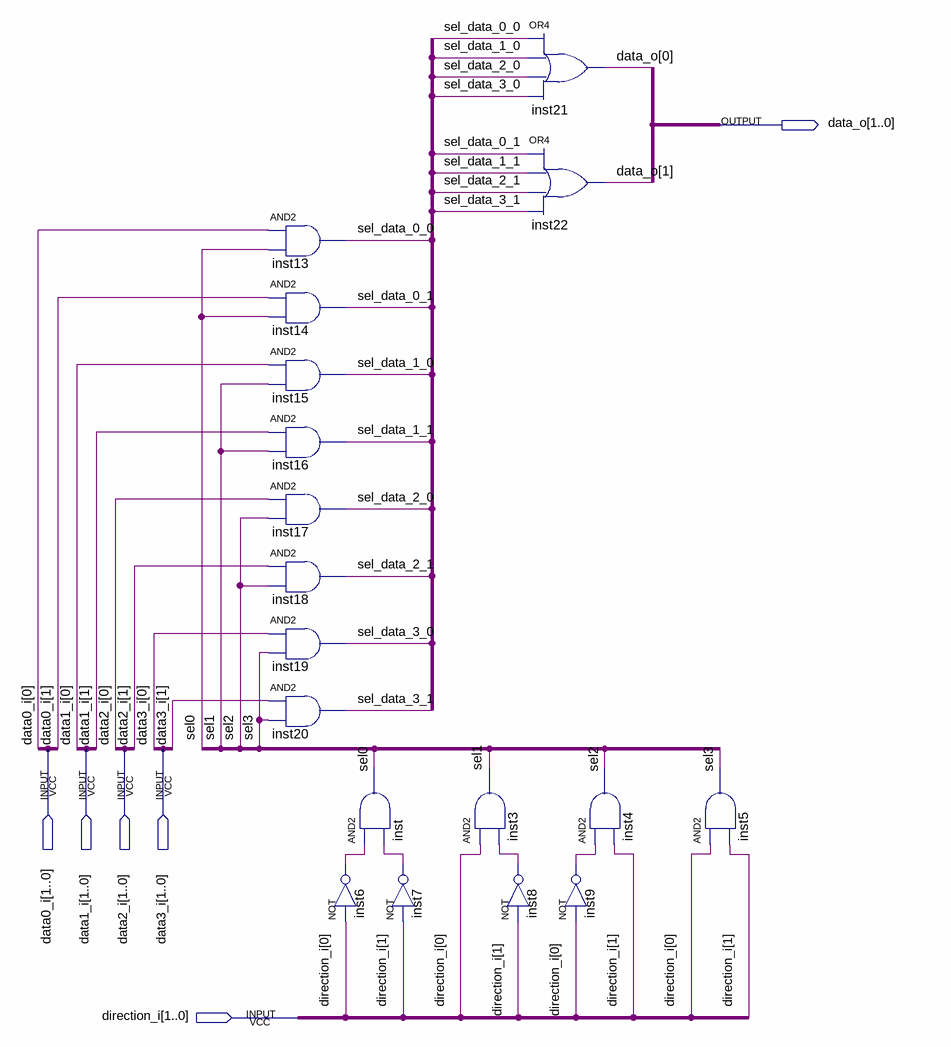
[diagram p0: schematic sheet]
// Quartus schematic mux_top.bdf as structural Verilog: 18 symbols, 6 pins
module mux_top (
  input  [1:0] data0_i,
  input  [1:0] data1_i,
  input  [1:0] data2_i,
  input  [1:0] data3_i,
  input  [1:0] direction_i,
  output [1:0] data_o
);

  wire inst6_out, inst7_out, inst8_out, inst9_out, sel0, sel1, sel2, sel3, sel_data_0_0, sel_data_0_1,
       sel_data_1_0, sel_data_1_1, sel_data_2_0, sel_data_2_1, sel_data_3_0, sel_data_3_1;

  and inst13 (sel_data_0_0, data0_i[0], sel0);
  and inst14 (sel_data_0_1, data0_i[1], sel0);
  and inst15 (sel_data_1_0, data1_i[0], sel1);
  and inst16 (sel_data_1_1, data1_i[1], sel1);
  and inst17 (sel_data_2_0, data2_i[0], sel2);
  and inst18 (sel_data_2_1, data2_i[1], sel2);
  and inst19 (sel_data_3_0, data3_i[0], sel3);
  and inst20 (sel_data_3_1, data3_i[1], sel3);
  not inst6 (inst6_out, direction_i[0]);
  and inst (sel0, inst6_out, inst7_out);
  not inst7 (inst7_out, direction_i[1]);
  and inst3 (sel1, direction_i[0], inst8_out);
  or inst21 (data_o[0], sel_data_0_0, sel_data_1_0, sel_data_2_0, sel_data_3_0);
  or inst22 (data_o[1], sel_data_0_1, sel_data_1_1, sel_data_2_1, sel_data_3_1);
  not inst8 (inst8_out, direction_i[1]);
  not inst9 (inst9_out, direction_i[0]);
  and inst4 (sel2, inst9_out, direction_i[1]);
  and inst5 (sel3, direction_i[0], direction_i[1]);
endmodule
